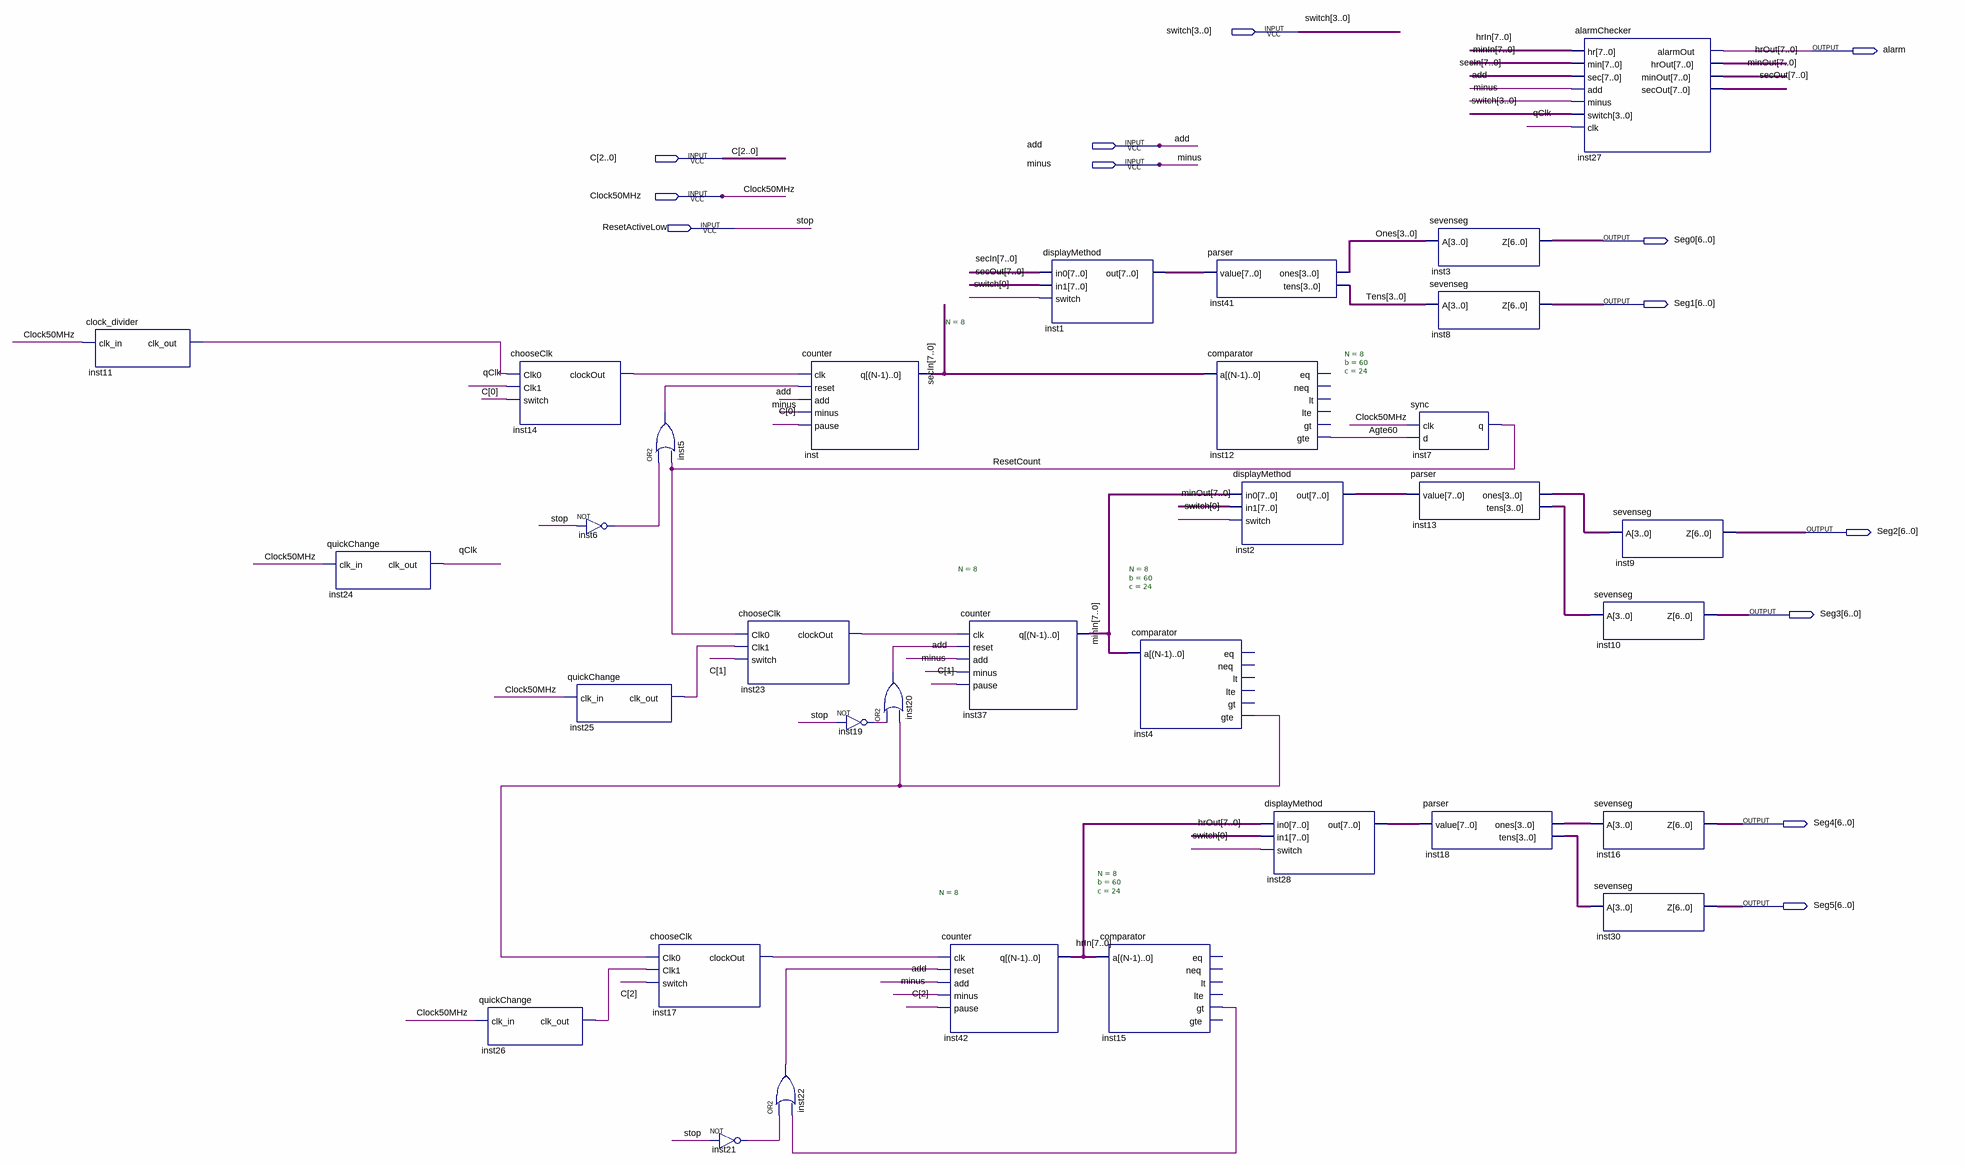
[diagram p0: schematic sheet]
// Quartus schematic lab5.bdf as structural Verilog: 33 symbols, 13 pins
module lab5 (
  input  [3:0] switch,
  input  add,
  input  [2:0] C,
  input  minus,
  input  Clock50MHz,
  input  ResetActiveLow,
  output alarm,
  output [6:0] Seg0,
  output [6:0] Seg1,
  output [6:0] Seg2,
  output [6:0] Seg3,
  output [6:0] Seg4,
  output [6:0] Seg5
);

  wire Agte60, inst4_gte, inst5_out, inst6_out, inst11_clk_out, inst14_clockout, inst15_gt, inst17_clockout,
       inst19_out, inst20_out, inst21_out, inst22_out, inst23_clockout, inst25_clk_out, inst26_clk_out, qClk,
       ResetCount;
  wire [3:0] inst13_ones, inst13_tens, inst18_ones, inst18_tens, Ones, Tens;
  wire [7:0] hrIn, hrOut, inst1_out, inst2_out, inst28_out, minIn, minOut, secIn, secOut;

  clock_divider inst11 (.clk_in(Clock50MHz), .clk_out(inst11_clk_out));
  quickChange inst24 (.clk_in(Clock50MHz), .clk_out(qClk));
  quickChange inst26 (.clk_in(Clock50MHz), .clk_out(inst26_clk_out));
  chooseClk inst14 (.Clk0(inst11_clk_out), .Clk1(qClk), .switch(C[0]), .clockOut(inst14_clockout));
  not inst6 (inst6_out, ResetActiveLow);
  quickChange inst25 (.clk_in(Clock50MHz), .clk_out(inst25_clk_out));
  or inst5 (inst5_out, inst6_out, ResetCount);
  chooseClk inst17 (.Clk0(inst4_gte), .Clk1(inst26_clk_out), .switch(C[2]), .clockOut(inst17_clockout));
  chooseClk inst23 (.Clk0(ResetCount), .Clk1(inst25_clk_out), .switch(C[1]), .clockOut(inst23_clockout));
  not inst21 (inst21_out, ResetActiveLow);
  counter #(.N(8)) inst (.clk(inst14_clockout), .reset(inst5_out), .add(add), .minus(minus), .pause(C[0]), .q(secIn));
  or inst22 (inst22_out, inst21_out, inst15_gt);
  not inst19 (inst19_out, ResetActiveLow);
  or inst20 (inst20_out, inst19_out, inst4_gte);
  counter #(.N(8)) inst42 (.clk(inst17_clockout), .reset(inst22_out), .add(add), .minus(minus), .pause(C[2]), .q(hrIn));
  counter #(.N(8)) inst37 (
    .clk(inst23_clockout), .reset(inst20_out), .add(add), .minus(minus), .pause(C[1]), .q(minIn));
  displayMethod inst1 (.in0(secIn), .in1(secOut), .switch(switch[0]), .out(inst1_out));
  comparator #(.N(8), .b(60), .c(24)) inst15 (.a(hrIn), .gt(inst15_gt));  // open: eq, neq, lt, lte, gte
  comparator #(.N(8), .b(60), .c(24)) inst4 (.a(minIn), .gte(inst4_gte));  // open: eq, neq, lt, lte, gt
  parser inst41 (.value(inst1_out), .ones(Ones), .tens(Tens));
  comparator #(.N(8), .b(60), .c(24)) inst12 (.a(secIn), .gte(Agte60));  // open: eq, neq, lt, lte, gt
  displayMethod inst2 (.in0(minIn), .in1(minOut), .switch(switch[0]), .out(inst2_out));
  displayMethod inst28 (.in0(hrIn), .in1(hrOut), .switch(switch[0]), .out(inst28_out));
  sync inst7 (.clk(Clock50MHz), .d(Agte60), .q(ResetCount));
  parser inst13 (.value(inst2_out), .ones(inst13_ones), .tens(inst13_tens));
  sevenseg inst3 (.A(Ones), .Z(Seg0));
  sevenseg inst8 (.A(Tens), .Z(Seg1));
  parser inst18 (.value(inst28_out), .ones(inst18_ones), .tens(inst18_tens));
  alarmChecker inst27 (
    .hr(hrIn), .min(minIn), .sec(secIn), .add(add), .minus(minus), .switch(switch), .clk(qClk),
    .alarmOut(alarm), .hrOut(hrOut), .minOut(minOut), .secOut(secOut));
  sevenseg inst9 (.A(inst13_ones), .Z(Seg2));
  sevenseg inst10 (.A(inst13_tens), .Z(Seg3));
  sevenseg inst16 (.A(inst18_ones), .Z(Seg4));
  sevenseg inst30 (.A(inst18_tens), .Z(Seg5));

  // Other names for the same wires on the sheet: stop = ResetActiveLow
endmodule
